# EAGLE design Adafruit KB2040 (EAGLE 9.6.2)
COMPANY: ADAFRUIT INDUSTRIES; DRAWN: KTOWN; REV: B
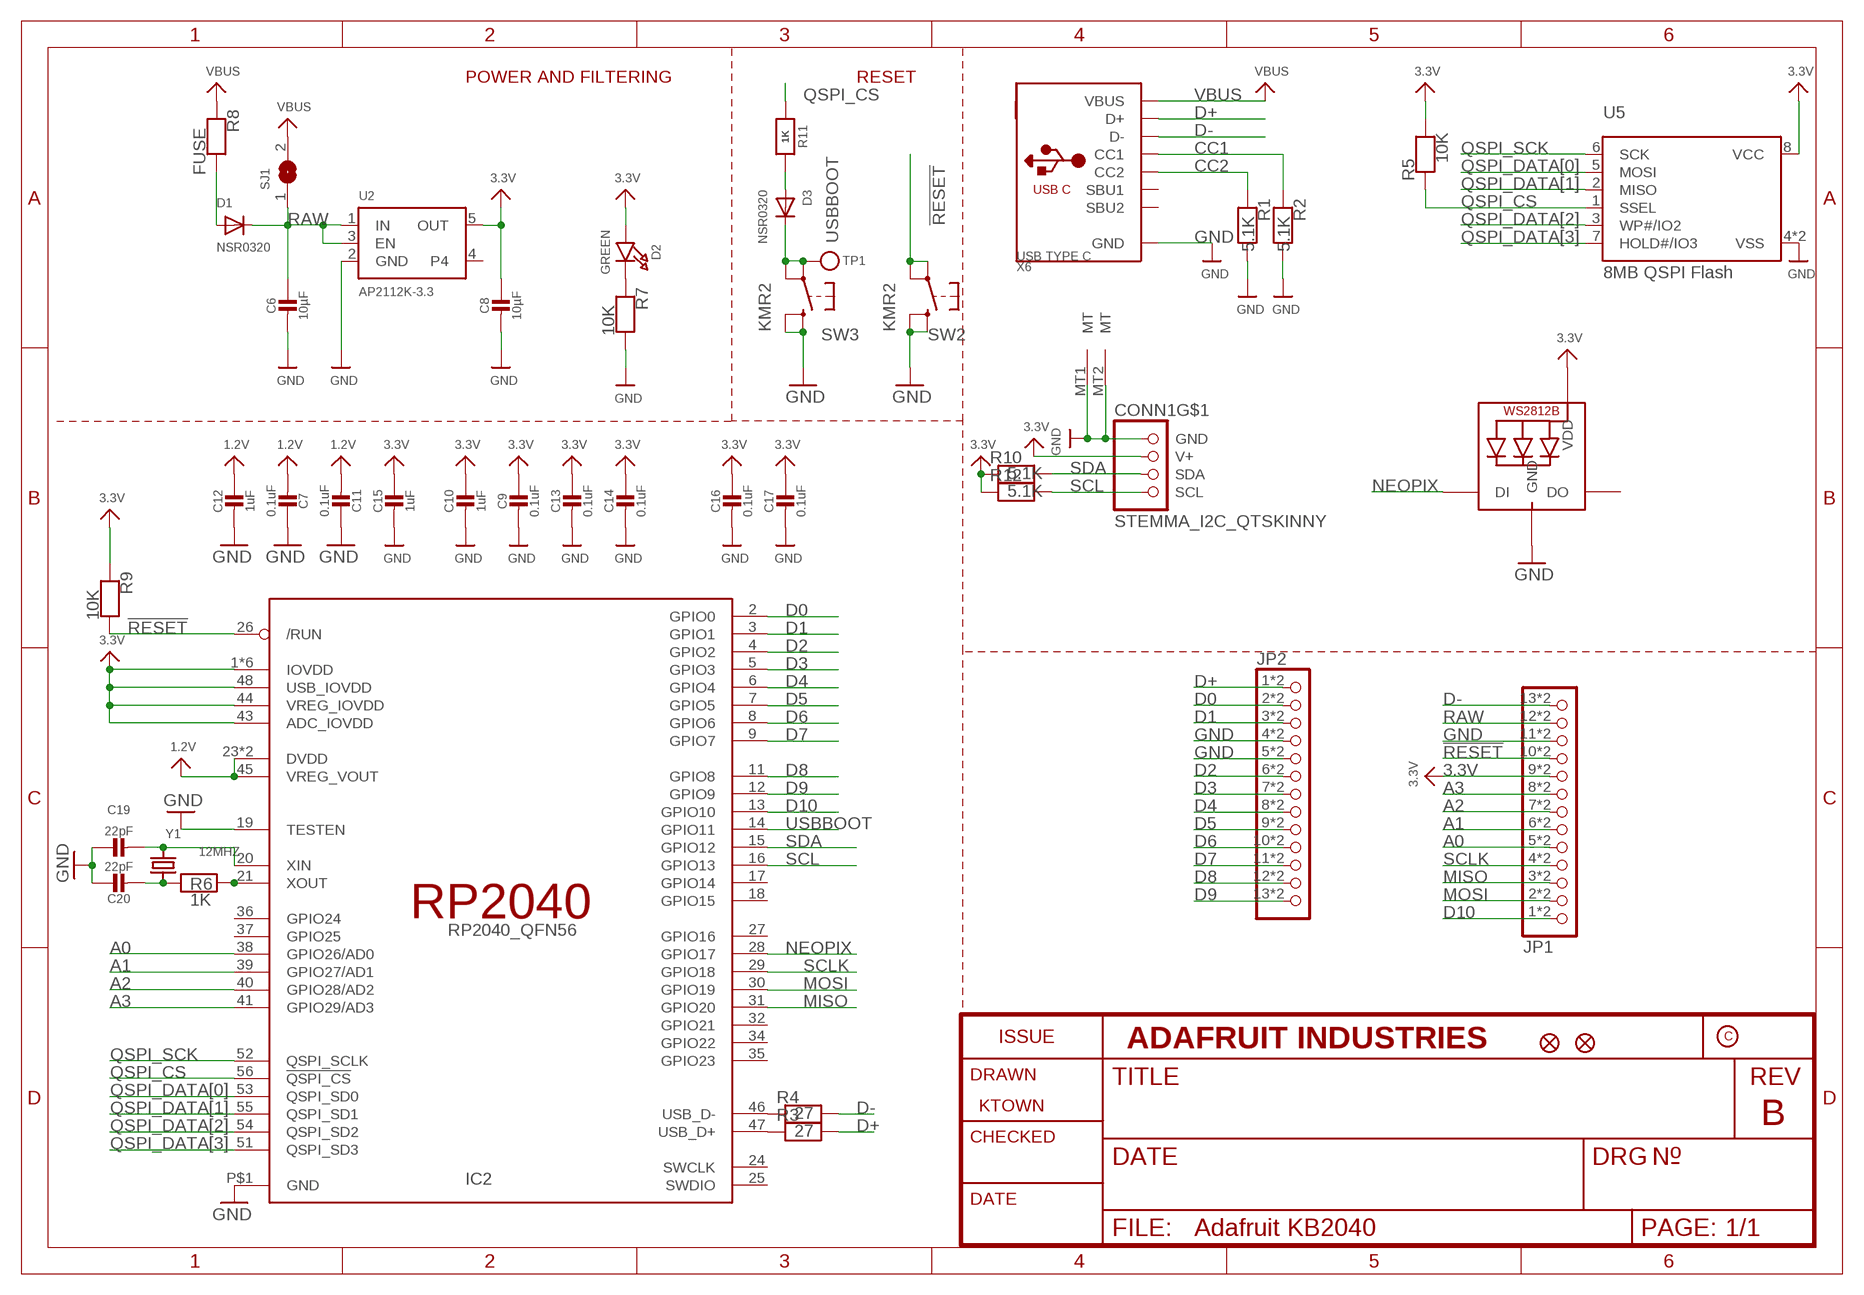
[diagram p0: schematic, sheet 1]

## Parts
C6  10µF  CAP_CERAMIC_0805MP  [_0805MP]
C7  0.1uF  CAP_CERAMIC_0402NO  [_0402NO]
C8  10µF  CAP_CERAMIC_0805MP  [_0805MP]
C9  0.1uF  CAP_CERAMIC_0402NO  [_0402NO]
C10  1uF  CAP_CERAMIC_0603MP  [_0603MP]
C11  0.1uF  CAP_CERAMIC_0402NO  [_0402NO]
C12  1uF  CAP_CERAMIC_0603MP  [_0603MP]
C13  0.1uF  CAP_CERAMIC_0402NO  [_0402NO]
C14  0.1uF  CAP_CERAMIC_0402NO  [_0402NO]
C15  1uF  CAP_CERAMIC0603_NO  [0603-NO]
C16  0.1uF  CAP_CERAMIC_0402NO  [_0402NO]
C17  0.1uF  CAP_CERAMIC_0402NO  [_0402NO]
C19  22pF  CAP_CERAMIC_0402NO  [_0402NO]
C20  22pF  CAP_CERAMIC_0402NO  [_0402NO]
CONN1  STEMMA_I2C_QTSKINNY  [JST_SH4_SKINNY]
D1  NSR0320  DIODESOD-323F  [SOD-323F]
D2  GREEN  LED0603_NOOUTLINE  [CHIPLED_0603_NOOUTLINE]
D3  NSR0320  DIODESOD-323F  [SOD-323F]
IC2  RP2040_QFN56  [QFN56_7MM_REDUCEDEPAD]
JP1  HEADER-1X13_CASTEL  [1X13_CASTEL]
JP2  HEADER-1X13_CASTEL  [1X13_CASTEL]
LED1  WS2812B_SK6805_1515  [SK6805_1515]
R1  5.1K  RESISTOR_0402NO  [_0402NO]
R2  5.1K  RESISTOR_0402NO  [_0402NO]
R3  27  RESISTOR_0402NO  [_0402NO]
R4  27  RESISTOR_0402NO  [_0402NO]
R5  10K  RESISTOR_0402NO  [_0402NO]
R6  1K  RESISTOR_0402NO  [_0402NO]
R7  10K  RESISTOR_0402NO  [_0402NO]
R8  FUSE  RESISTOR0805_NOOUTLINE  [0805-NO]
R9  10K  RESISTOR_0402NO  [_0402NO]
R10  5.1K  RESISTOR_0402NO  [_0402NO]
R11  1K  RESISTOR_0402NO  [_0402NO]
R12  5.1K  RESISTOR_0402NO  [_0402NO]
SJ1  SOLDERJUMPER  [SOLDERJUMPER_ARROW_NOPASTE]
SW2  KMR2  SWITCH_TACT_SMT4.6X2.8  [BTN_KMR2_4.6X2.8]
SW3  KMR2  SWITCH_TACT_SMT4.6X2.8  [BTN_KMR2_4.6X2.8]
TP1  TESTPOINTROUND1.5MMNO  [TESTPOINT_ROUND_1.5MM_NO]
U2  AP2112K-3.3  VREG_SOT23-5  [SOT23-5]
U5  8MB QSPI Flash  SPIFLASH_8PIN_4X4  [USON8_4X4]
U$34  FIDUCIAL_1MM  [FIDUCIAL_1MM]
U$35  FIDUCIAL_1MM  [FIDUCIAL_1MM]
X6  USB TYPE C  USB_C  [USB_C_CUSB31-CFM2AX-01-X]
Y1  12MHZ  CRYSTAL2.5X2.0  [CRYSTAL_2.5X2]

## Nets
1.2V [power]: C7.2 C11.2 C12.1 IC2.23(DVDD) IC2.45(VREG_VOUT) IC2.50(DVDD)
3.3V [power]: C8.1 C9.1 C10.1 C13.1 C14.1 C15.1 C16.1 C17.1 CONN1.2(V+) D2.A IC2.1(IOVDD) IC2.10(IOVDD) IC2.22(IOVDD) IC2.33(IOVDD) IC2.42(IOVDD) IC2.43(ADC_IOVDD) IC2.44(VREG_IOVDD) IC2.48(USB_IOVDD) IC2.49(IOVDD) JP1.9 JP1.9C LED1.2(VDD) R5.2 R9.1 R10.1 R12.1 U2.5(OUT) U5.8(VCC)
!RESET: IC2.26(/RUN) JP1.10 JP1.10C R9.2 SW2.A'(P1) SW2.A(P)
A0: IC2.38(GPIO26/AD0) JP1.5 JP1.5C
A1: IC2.39(GPIO27/AD1) JP1.6 JP1.6C
A2: IC2.40(GPIO28/AD2) JP1.7 JP1.7C
A3: IC2.41(GPIO29/AD3) JP1.8 JP1.8C
CC1: R2.1 X6.A5(CC1)
CC2: R1.1 X6.B5(CC2)
D0: IC2.2(GPIO0) JP2.2 JP2.2C
D1: IC2.3(GPIO1) JP2.3 JP2.3C
D2: IC2.4(GPIO2) JP2.6 JP2.6C
D3: IC2.5(GPIO3) JP2.7 JP2.7C
D4: IC2.6(GPIO4) JP2.8 JP2.8C
D5: IC2.7(GPIO5) JP2.9 JP2.9C
D6: IC2.8(GPIO6) JP2.10 JP2.10C
D7: IC2.9(GPIO7) JP2.11 JP2.11C
D8: IC2.11(GPIO8) JP2.12 JP2.12C
D9: IC2.12(GPIO9) JP2.13 JP2.13C
D10: IC2.13(GPIO10) JP1.1 JP1.1C
D+: JP2.1 JP2.1C R3.2 X6.A6(D+) X6.B6(D+)
D-: JP1.13 JP1.13C R4.2 X6.A7(D-) X6.B7(D-)
GND: C6.2 C7.1 C8.2 C9.2 C10.2 C11.1 C12.2 C13.2 C14.2 C15.2 C16.2 C17.2 C19.1 C20.1 CONN1.1(GND) CONN1.MT1(MT) CONN1.MT2(MT) IC2.19(TESTEN) IC2.P$1(GND) JP1.11 JP1.11C JP2.4 JP2.4C JP2.5 JP2.5C LED1.4(GND) R1.2 R2.2 R7.2 SW2.B'(S1) SW2.B(S) SW3.B'(S1) SW3.B(S) U2.2(GND) U5.4(VSS) U5.PAD(VSS) X6.A1B12(GND) X6.B1A12(GND)
MISO: IC2.31(GPIO20) JP1.3 JP1.3C
MOSI: IC2.30(GPIO19) JP1.2 JP1.2C
N$1: IC2.47(USB_D+) R3.1
N$2: D2.C R7.1
N$3: IC2.46(USB_D-) R4.1
N$4: D3.A R11.2
N$5: C19.2 IC2.20(XIN) Y1.3
N$6: C20.2 R6.1 Y1.1
N$7: IC2.21(XOUT) R6.2
N$8: D1.A R8.2
NEOPIX: IC2.28(GPIO17) LED1.1(DI)
QSPI_CS: IC2.56(!QSPI_CS) R5.1 R11.1 U5.1(SSEL)
QSPI_DATA[0]: IC2.53(QSPI_SD0) U5.5(MOSI)
QSPI_DATA[1]: IC2.55(QSPI_SD1) U5.2(MISO)
QSPI_DATA[2]: IC2.54(QSPI_SD2) U5.3(WP#/IO2)
QSPI_DATA[3]: IC2.51(QSPI_SD3) U5.7(HOLD#/IO3)
QSPI_SCK: IC2.52(QSPI_SCLK) U5.6(SCK)
RAW: C6.1 D1.C JP1.12 JP1.12C SJ1.1 U2.1(IN) U2.3(EN)
SCL: CONN1.4(SCL) IC2.16(GPIO13) R12.2
SCLK: IC2.29(GPIO18) JP1.4 JP1.4C
SDA: CONN1.3(SDA) IC2.15(GPIO12) R10.2
USBBOOT: D3.C IC2.14(GPIO11) SW3.A'(P1) SW3.A(P) TP1.P$1
VBUS: R8.1 SJ1.2 X6.A4B9(VBUS) X6.B4A9(VBUS)
Unconnected: IC2.17(GPIO14) IC2.18(GPIO15) IC2.24(SWCLK) IC2.25(SWDIO) IC2.27(GPIO16) IC2.32(GPIO21) IC2.34(GPIO22) IC2.35(GPIO23) IC2.36(GPIO24) IC2.37(GPIO25) LED1.3(DO) U2.4 X6.A8(SBU1) X6.B8(SBU2)

## Notes on the sheet
- POWER AND FILTERING | RESET

## Library data of the parts
C6 C7 C9-C17 C19 C20 = microbuilder:CAP_CERAMIC: Ceramic Capacitors For new designs, use the packages preceded by an '_' character since they are more reliable: The following footprints should be used on most boards: _0402 - Standard footprint for regular board layouts _0603 - Standard footprint for regular board layouts _0805 - Standard footprint for regular board layouts _1206 - Standard footprint for regular board layouts For extremely tight-pitch boards where space is at a premium, the following 'micro-pitch' footprints can be used (smaller pads, no silkscreen outline, etc.): _0402MP - Micro-pitch footprint for very dense/compact boards _0603MP - Micro-pitch footprint for very dense/compact boards _0805MP - Micro-pitch footprint for very dense/compact boards _1206MP - Micro-pitch footprint for very dense/compact boards
C8 = microbuilder:CAP_CERAMIC: Ceramic Capacitors For new designs, use the packages preceded by an '_' character since they are more reliable: The following footprints should be used on most boards: _0402 - Standard footprint for regular board layouts _0603 - Standard footprint for regular board layouts _0805 - Standard footprint for regular board layouts _1206 - Standard footprint for regular board layouts For extremely tight-pitch boards where space is at a premium, the following 'micro-pitch' footprints can be used (smaller pads, no silkscreen outline, etc.): _0402MP - Micro-pitch footprint for very dense/compact boards _0603MP - Micro-pitch footprint for very dense/compact boards _0805MP - Micro-pitch footprint for very dense/compact boards _1206MP - Micro-pitch footprint for very dense/compact boards; REV: B
CONN1 = microbuilder:STEMMA_I2C
D1 D3 = adafruit:DIODE: Diode SMADIODE - SMA Surface Mount Package 20V 1A Schottky Diode Digikey: 641-1014-6-ND DO-1N4148 - Through Hole Small Current Diode SOD-123 20V 1 A (.5mV Vf) Schottky Diode - Digikey: MBRX120TPMSCT-ND SOD-323 10V 570mA (.38mV Vf, 3ns) Schottky Diode - Digikey: ZLLS410CT-ND SOD-523 30V 30mA Schottky Diode (RB751S-40TE61) - Digikey: RB751S-40TE61CT-ND SOT23-R/W - SOT23 Package (R = Solder Paste/Reflow Ovens, W = Hand-Soldering) BAT54Film 40V 300mA - Digikey: 497-7162-1-ND
D2 = microbuilder:LED: LED 0603 - 0603 Surface Mount Package 2mA: Green LED - Low Power (3.9mcd, 2ma, 1.7Vf) - Digikey: 475-2709-2-ND Orange LED - Low Power (9.8mcd, 2ma, 1.8Vf) - Digikey: 475-1194-2-ND Red LED - Low Power (5mcd, 2ma, 1.8Vf) - Digikey: 475-1195-2-ND Yellow LED - Low Power (7mcd, 2ma, 1.8Vf) - Digikey: 475-1196-2-ND 5mA: Blue LED - Low Power (17mcd, 5ma, 2.9Vf) - Digikey: LNJ937W8CRACT-ND 0805 - 0805 Surface Mount Package 2mA: Red LED (8.8mcd, 2mA, 1.8Vf, Clear) - Low Power [Digikey: 475-2510-1-ND] Green LED (5mcd, 2mA, 1.8Vf, Clear) - Low Power [Digikey: 475-2730-1-ND] Yellow LED (11.3mcd, 2mA, 1.8Vf, Clear) - Low Power [Digikey: 475-2555-1-ND] 20mA: Red LED (104mcd, 20mA, Diffused) - LS R976 [Digikey: 475-1278-6-ND] Red LED (12mcd, 20mA, 2.0Vf, Clear) - APT2012EC [Digikey: 754-1128-1-ND] Green LED (15mcd, 20mA, 2.2Vf, Clear) - APT2012GC [Digikey: 754-1131-1-ND] Orange LED (160mcd, 20mA, 2.1Vf, Clear) - APT2012SECK [Digikey: 754-1130-1-ND] 1206 - 1206 Surface Mount Package Green LED (26mcd, 20mA, Diffused) - LG N971 [Digikey: 475-1407-6-ND] Red LED (15mcd, 20mA, Diffused) - LH N974 [Digikey: 475-1416-6-ND] Cree - Cree High-Power Surface Mount LEDs XPEBWT-L1-0000-00D50 - White 111lm 350mA 2.9Vf 6200K 110° XTEAWT-00-0000-00000LEE3 - White 114lm 350mA 2.85Vf 5000K 115° Everlight - Everlight 45-21 Series Surface Mount LEDs 45-21/QK2C-B2832AC2CB2/2T - Warm White 2000mcd 20mA 3.25Vf 3050K 120° 45-21/LK2C-B38452C4CB2/2T - Nuetral White 2000mcd 20mA 3.25Vf 4150K 120° 45-21/LK2C-B50634C6CB2/2T - Cold White 2200mcd 20mA 3.25Vf 5650K 120° PLCC2 Reverse Mount LS T77K-J1L2-1-0-2-R18-Z - Red 11.25mcd 2mA 1.8Vf 630nm 120° LO T77K-L1M2-24-Z - Orange 19.6mcd 2mA 1.8Vf 606nm 120° LY T77K-K2M1-26-Z - Yellow 15.7mcd 2mA 1.8Vf 587nm 120°
IC2 = adafruit_micro:RP2040
JP1 JP2 = microbuilder:HEADER-1X13
LED1 = microbuilder:WS2812B
R1-R12 = microbuilder:RESISTOR: Resistors For new designs, use the packages preceded by an '_' character since they are more reliable: The following footprints should be used on most boards: _0402 - Standard footprint for regular board layouts _0603 - Standard footprint for regular board layouts _0805 - Standard footprint for regular board layouts _1206 - Standard footprint for regular board layouts For extremely tight-pitch boards where space is at a premium, the following 'micro-pitch' footprints can be used (smaller pads, no silkscreen outline, etc.): _0402MP - Micro-pitch footprint for very dense/compact boards _0603MP - Micro-pitch footprint for very dense/compact boards _0805MP - Micro-pitch footprint for very dense/compact boards _1206MP - Micro-pitch footprint for very dense/compact boards
SJ1 = microbuilder:SOLDERJUMPER: SMD Solder JUMPER Solder the two pads together to create a connection, or remove the solder to break it. REFLOW - Use this footprint for solder paste and reflow ovens. WAVE - Use this footprint for hand-soldering (larger pads). CLOSED - Has a trace between the two pads to ensure it is closed by default. The trace needs to be cut to disable the jumper, and can be closed again by creating a solder bridge between the two pads.; BOM: EXCLUDE
SW2 SW3 = microbuilder:SWITCH_TACT_SMT: SMT Tact Switches 6x6mm - Digikey: P12940SCT-ND KMR2 (4.6x2.8mm) - Digikey: 401-1426-1-ND EVQ-PQHB55 - Light Touch, 160GF (4.5x4.5mm) - Digikey: P8090SCT-ND KMT0 - KMT021 NGJ LHS (etc.) IP68/Waterproof - Digikey: CKN10289CT-ND
TP1 = microbuilder:TESTPOINT: Test Point Various test points for characterisation and PCB testing TESTPOINT_SMT - Compact Surface Mount Test Point [Digikey: 5016KTR-ND]
U2 = microbuilder:VREG_SOT23-5: SOT23-5 Fixed Voltage Regulators Part Current Out V Out V In V Dropout θJA (°C/W) TJ (°C) Digikey Part No. ADP121 150mA 3.3V 3.4-5.5V 0.09V @ 150mA -- -- ADP121-AUJZ33R7CT-ND ADP121 150mA 3.0V 3.1-5.5V 0.09V @ 150mA -- -- ADP121-AUJZ30R7CT-ND ADP122 300mA 3.3V 3.4-5.5V 0.085V @ 300mA -- -- ADP122AUJZ-3.3-R7CT-ND ADP1712 300mA 3.3V 3.5-5.5V 0.17V @ 300mA -- -- ADP1712AUJZ-3.3-R7TR-ND AP7311 (Low Cost) 150mA 3.3V 3.5-6V 0.15V @ 150mA -- -- AP7311-33WG-7DICT-ND LD39015M18R 150mA 1.8V 1.9V-5.5V 0.08V @ 100mA -- -- 497-6977-1-ND LP2985A-33DBVR 150mA 3.3V 3.3-16V 0.28V @ 150mA 206 150 296-18479-1-ND MCP1824T-3302E/OT 300mA 3.3V 3.5V-6V 0.2V @ 300mA -- -- MCP1824T-3302E/OTCT-ND MIC5205-2.5YM5 TR 150mA 2.5V 2.7-16V 0.165V @ 150mA -- -- 576-1257-2-ND MIC5205-3.0YM5 TR 150mA 3.0V 3.2V-16V 0.165V @ 150mA -- -- 576-1258-2-ND MIC5205-3.3YM5 TR 150mA 3.3V 3.5V-16V 0.165V @ 150mA -- -- 576-1259-2-ND TPS780330220 150mA 3.3V+2.2V 3.6-5.5V 250mV Max -- -- 296-23332-1-ND TDA3663/N1,135 100mA 3.3V 3.5-45V 0.18V @ 50mA -- -- 568-5343-1-ND Max operating temp can be calculated using θJA, TJ (max junction temperature), and power in watts. Set the "Maximum Ambient Temperature" until it reaches TJ ("Max Junction Temperature"), which is the absolute limit for safe use of the regulator: Heat Sink Temperature Calculator <http://www.daycounter.com/Calculators/Heat-Sink-Temperature-Calculator.phtml> For example, With 12V source into a 3.3V LP2985 and a 30mA load, we are dissipating (12V-3.3V) * 0.03A = 0.261W. With a θJA of 206 °C/W, a TJ of 150°C, and 261mW we can safely use the chip without a heat sink up to 75°C (=147.1°C Junction Temperature).
U5 = microbuilder:SPIFLASH_8PIN: SOIC8 SPI Flash Be careful with the size since SOIC8 flash comes in several 'widths' SOIC8 150 mil M25P16 - 16Mbit (2Mbit x 8) Serial Flash (75MHz SPI Bus), Supply: 2.7-3.6V Digikey: SOIC8 - M25P16-VMN6P-ND SOIC8 208 mil W25Q16BVSSIG - 16Mbit (2Mbit x 8) Serial Flash (104MHz SPI Bus), Supply: 2.7-3.6V Digikey: SOIC8 - W25Q16BVSSIG-ND
U$34 U$35 = microbuilder:FIDUCIAL: Fiducial Alignment Points Various fiducial points for machine vision alignment.; BOM: EXCLUDE
X6 = adafruit_electromech:USB_C: USB Type-C USB 2.0 Connector
Y1 = microbuilder:CRYSTAL: Crystals HC49UP - Surface Mount Crystal 4.0MHz 18pF +/-30ppm Surface Mount Crystal [Digikey: 535-9857-1-ND] 12.0 MHz Surface Mount Crystal [Digikey: 535-9869-6-ND] 25.0 MHz Surface Mount Crystal [Digikey: 535-9078-1-ND] 2.5 x 2.0mm - MEMs SMT Crystal 16.0 MHz 10pF 20ppm 2.5 x 2.0mm Crystal [Digikey -40-85°C: 535-10923-1-ND] 3.2 x 2.5mm - MEMs SMT Crystal 12.0 MHz 8pF 15ppm 3.2 x 2.5mm Crystal [Digikey: -10-70°C: 644-1047-1-ND -40-125°C: 644-1128-1-ND] 40~85°C cheaper: 644-1173-6-ND 16.0 MHz 8pF 15ppm 3.2 x 2.5mm Crystal [Digikey: -10-70°C: 644-1049-1-ND -40-125°C: 644-1129-2-ND]-40~85°C cheaper: 644-1175-6-ND 16.0 MHz 10pF 10ppm 3.2 x 2.5mm Crystal [Digikey: 644-1100-1-ND] 27.12 MHz 18pF 30ppm 3.2 x 2.5mm Crystal [Digikey: 887-1424-1-ND] 27.12MHz 10pF 10ppm 3.2 x 2.5mm Crystal [Digikey: 887-1329-1-ND] 4.9 x 1.8mm - MEMs SMT Crystal 32.768 KHz 12.5pF 20ppm 4.9 x 1.8mm Crystal [Digikey: SE2415CT-ND] 8.0 x 3.8mm - Surface Mount Crystal 32.768kHz 12.5pF 20ppm -40°C-85°C [Digikey: 535-9166-2-ND] Cylinder 32.768KHz Cylinder Crystal (2x6mm body) [Ex. Digikey: 300-8341-2-ND]

## Net classes
1 power: width 0.203 mm

## Board
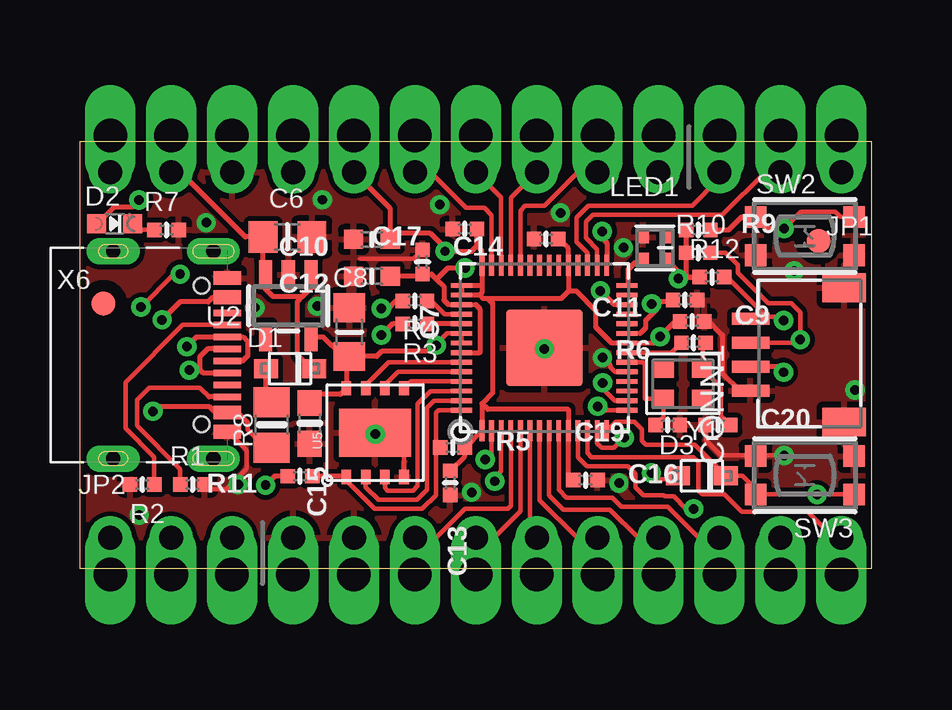
[diagram p1: board, top side]
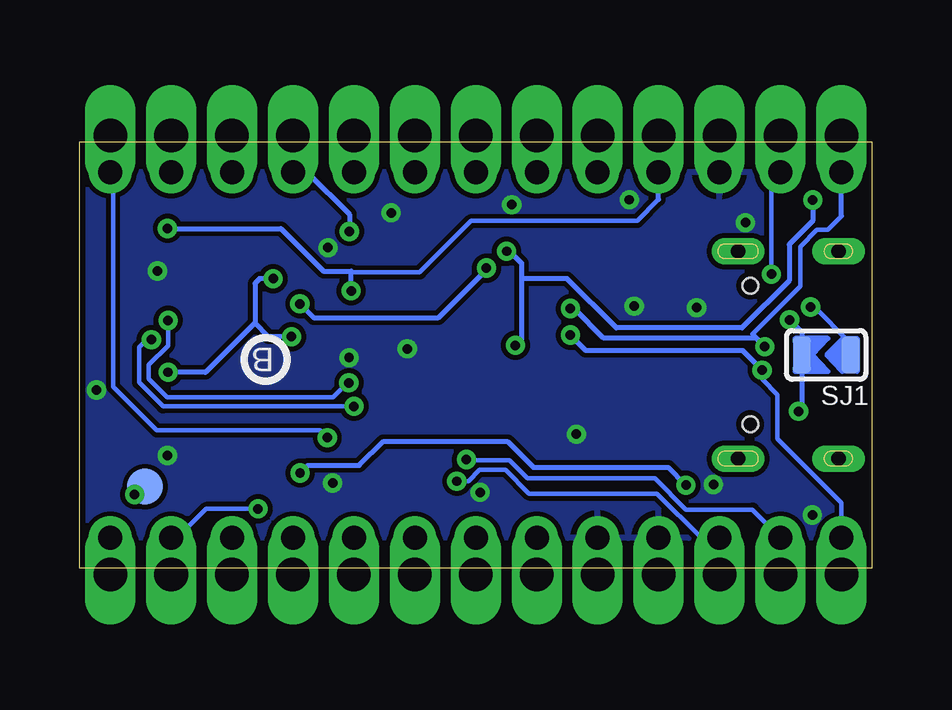
[diagram p2: board, bottom side, seen from below]

Size 33.02 x 17.78 mm. Coordinates in mm from the lower left corner, seen from the top.
Outline: 0,17.78 0,0 33.02,0 33.02,17.78 0,17.78
Copper layers (1*16): Top 0.035mm / dielectric 1.5mm / Bottom 0.035mm
Design rules "adafruit 7-7 *": minimum track width 7mil, minimum drill 15.5mil, track to track 8mil, track to pad 7mil, pad to pad 7mil, via to via 7mil, smd to smd 7mil, copper to edge 10mil, drill to drill 8mil, minimum pad ring 10mil, minimum via ring 8mil, stop-mask expansion 2mil, vias tented up to drill 20mil, thermal gap 10mil

### Footprints (pad centres in the part's own frame; a part is rotated, then mirrored left to right if it is on the bottom)
_0805MP = smd 1.2 x 1.3: 1 -1.016,0; 2 1.016,0
_0402NO = smd 0.6 x 0.6: 1 -0.508,0; 2 0.508,0
_0603MP = smd 0.8 x 0.8: 1 -0.762,0; 2 0.762,0
0603-NO = smd 1.075 x 1: 1 -0.85,0; 2 0.85,0
JST_SH4_SKINNY = smd 0.5 x 1.55: 1 -1.5,2.514; 2 -0.5,2.514; 3 0.5,2.514; 4 1.5,2.514 | smd 1.2 x 1.8: MT1 -2.8,-1.386; MT2 2.8,-1.386
SOD-323F = smd 1 x 0.8: A -1,0; C 1,0
CHIPLED_0603_NOOUTLINE = smd 0.8 x 0.8: A 0,-0.75; C 0,0.75
QFN56_7MM_REDUCEDEPAD = smd 0.875 x 0.2: 1 -3.45,2.6; 2 -3.45,2.2; 3 -3.45,1.8; 4 -3.45,1.4; 5 -3.45,1; 6 -3.45,0.6; 7 -3.45,0.2; 8 -3.45,-0.2; 9 -3.45,-0.6; 10 -3.45,-1; 11 -3.45,-1.4; 12 -3.45,-1.8; 13 -3.45,-2.2; 14 -3.45,-2.6; 29 3.45,-2.6; 30 3.45,-2.2; 31 3.45,-1.8; 32 3.45,-1.4; 33 3.45,-1; 34 3.45,-0.6; 35 3.45,-0.2; 36 3.45,0.2; 37 3.45,0.6; 38 3.45,1; 39 3.45,1.4; 40 3.45,1.8; 41 3.45,2.2; 42 3.45,2.6 | smd 0.2 x 0.875: 15 -2.6,-3.45; 16 -2.2,-3.45; 17 -1.8,-3.45; 18 -1.4,-3.45; 19 -1,-3.45; 20 -0.6,-3.45; 21 -0.2,-3.45; 22 0.2,-3.45; 23 0.6,-3.45; 24 1,-3.45; 25 1.4,-3.45; 26 1.8,-3.45; 27 2.2,-3.45; 28 2.6,-3.45; 43 2.6,3.45; 44 2.2,3.45; 45 1.8,3.45; 46 1.4,3.45; 47 1,3.45; 48 0.6,3.45; 49 0.2,3.45; 50 -0.2,3.45; 51 -0.6,3.45; 52 -1,3.45; 53 -1.4,3.45; 54 -1.8,3.45; 55 -2.2,3.45; 56 -2.6,3.45 | smd 3.2 x 3.2: P$1 0,0
1X13_CASTEL = drill 1 pad 1.778: 1 -15.24,0; 2 -12.7,0; 3 -10.16,0; 4 -7.62,0; 5 -5.08,0; 6 -2.54,0; 7 0,0; 8 2.54,0; 9 5.08,0; 10 7.62,0; 11 10.16,0; 12 12.7,0; 13 15.24,0 | drill 1.397 pad 1.778 long: 1C -15.24,-1.524; 2C -12.7,-1.524; 3C -10.16,-1.524; 4C -7.62,-1.524; 5C -5.08,-1.524; 6C -2.54,-1.524; 7C 0,-1.524; 8C 2.54,-1.524; 9C 5.08,-1.524; 10C 7.62,-1.524; 11C 10.16,-1.524; 12C 12.7,-1.524; 13C 15.24,-1.524
SK6805_1515 = smd 0.5 x 0.5: 1 -0.5,-0.45; 2 0.5,-0.45; 3 0.5,0.45; 4 -0.5,0.45
0805-NO = smd 1.24 x 1.5: 1 -0.95,0; 2 0.95,0
SOLDERJUMPER_ARROW_NOPASTE = smd 0.762 x 1.524: 1 -1.016,0; 2 1.016,0
BTN_KMR2_4.6X2.8 = smd 0.9 x 0.9: A 2.05,0.8; A' -2.05,0.8; B 2.05,-0.8; B' -2.05,-0.8
TESTPOINT_ROUND_1.5MM_NO = smd 1.5 x 1.5: P$1 0,0
SOT23-5 = smd 0.55 x 1.2: 1 -0.95,-1.3; 2 0,-1.3; 3 0.95,-1.3; 4 0.95,1.3; 5 -0.95,1.3
USON8_4X4 = smd 0.6 x 0.4: 1 -1.85,1.2; 2 -1.85,0.4; 3 -1.85,-0.4; 4 -1.85,-1.2; 5 1.85,-1.2; 6 1.85,-0.4; 7 1.85,0.4; 8 1.85,1.2 | smd 2 x 3: PAD 0,0
FIDUCIAL_1MM = smd 1 x 1: 1 0,0
USB_C_CUSB31-CFM2AX-01-X = smd 0.575 x 1.15: A1B12 -3.2,3.545; A4B9 -2.4,3.545; B1A12 3.2,3.545; B4A9 2.4,3.545 | smd 0.275 x 1.15: A5 -1.25,3.545; A6 -0.25,3.545; A7 0.25,3.545; A8 1.25,3.545; B5 1.75,3.545; B6 0.75,3.545; B7 -0.75,3.545; B8 -1.75,3.545 | drill 0.6 pad 1 long: M1 -4.32,2.97; M2 4.32,2.97; M3 -4.32,-1.21; M4 4.32,-1.21 | hole 0.65: 2.89,2.47; -2.89,2.47
CRYSTAL_2.5X2 = smd 0.9 x 0.75: 1 -0.825,-0.625; 2 0.825,-0.625; 3 0.825,0.625; 4 -0.825,0.625

### Placement (x,y rotation side)
C6  8.66,13.8 0 top
C7  14.29,12.76 270 top
C8  11.24,9.84 90 top
C9  25.53,10.29 0 top
C10  12.18,13.7 180 top
C11  25.23,11.18 180 top
C12  12.18,12.17 180 top
C13  15.44,3.56 270 top
C14  19.44,13.72 180 top
C15  9.59,6.03 270 top
C16  21.08,3.67 0 top
C17  16.05,14.14 180 top
C19  24.51,5.97 180 top
C20  26.61,5.97 0 top
CONN1  30.48,8.89 90 top
D1  8.76,8.32 0 top
D2  1.46,14.35 270 top
D3  25.93,3.85 0 top
IC2  19.37,9.18 90 top
JP1  16.51,16.51 180 top
JP2  16.51,1.27 0 top
LED1  23.98,13.35 0 top
R1  4.7,3.49 0 top
R2  2.6,3.49 180 top
R3  13.97,10.19 180 top
R4  13.97,11.14 180 top
R5  15.54,5.03 0 top
R6  25.59,9.4 180 top
R7  3.62,14.1 0 top
R8  8,5.97 90 top
R9  25.78,14.1 0 top
R10  25.78,13.14 0 top
R11  9.18,3.84 180 top
R12  26.35,12.13 0 top
SJ1  1.91,8.89 180 bottom
SW2  30.23,13.84 0 top
SW3  30.23,3.87 180 top
TP1  30.3,3.4 0 bottom
U2  8.7,10.93 180 top
U5  12.32,5.65 90 top
U$17  [KB2040_BOT]  0,17.78 180 bottom
U$19  [KB2040_TOP]  0,0 0 top
U$20  [PCBFEAT-REV-040]  25.27,8.7 180 bottom
U$34  30.8,13.64 270 top
U$35  0.99,11.03 270 top
X6  2.6,8.89 270 top
Y1  25.15,7.68 180 top

### Tracks (layer width: path | path; a pad name or v marks a point on that pad's centre or on a via)
1.2V  (via drill 0.39)
  Top 0.178: 15.37,10.98 IC2.45 16.51,10.98 | 23.37,9.78 IC2.23
  Top 0.203: 15.37,10.98 15.18,11.18 15.18,11.75 14.86,12.06 | C11.2 24.66,11.11 23.94,11.11 v23.84,11.02 24.04,10.83 24.04,10.76 23.59,10.32 23.59,10 23.37,9.78 | IC2.50 16.67,8.98 16.7,9.02 16.7,10.79 16.51,10.98 | C12.1 14.2,12.17 C7.2 14.67,12.26 14.86,12.06 | v16.07,12.51 15.33,12.51 14.89,12.06 14.86,12.06
  Bottom 0.203: v23.84,11.02 23.27,10.45 18.07,10.45 16.07,12.45 v16.07,12.51
3.3V  (via drill 0.39)
  Top 0.178: IC2.49 IC2.48 15.31,9.78 14.86,9.34 | IC2.22 23.75,9.38
  Top 0.203: U2.5 10.15,9.63 10.96,8.83 C8.1 | C15.1 9.65,6.88 10.02,7.25 10.87,7.25 U5.8 11.12,8.71 C8.1 | 14.86,9.34 v14.86,9.29 14.61,9.04 12.59,9.04 12.38,8.83 C8.1 | 16.68,11.39 16.83,11.24 17.02,11.24 | 16.77,11.81 IC2.42 16.77,13.23 16.56,13.44 | 16.77,11.81 16.77,11.48 16.68,11.39 | IC2.44 IC2.43 16.74,11.78 16.77,11.81 | 20.37,11.54 IC2.33 20.37,13.33 19.98,13.72 C14.1 | 17.02,11.24 20.07,11.24 20.37,11.54 | C16.1 20.37,3.67 IC2.10 20.37,6.62 17.01,6.62 16.77,6.86 | 23.75,9.38 23.92,9.38 v24.19,9.65 24.83,10.29 C9.1 | 17.02,11.24 17.21,11.05 17.21,7.3 16.77,6.86 | 16.77,6.86 IC2.1 16.76,5.73 R5.2 16.05,4.67 C13.1 | 16.56,13.44 C17.1 | IC2.22 22.18,9.38 21.53,10.03 21.53,10.73 20.72,11.54 20.37,11.54 | 16.56,13.44 16.33,13.21 v15.23,13.21 15.23,13.35 14.62,13.96 13.06,13.96 12.94,13.84 | v29.34,8.17 29.11,8.39 CONN1.2 | IC2.44 | IC2.44 16.68,11.39 | LED1.2 24.48,12.84 24.96,12.36 v24.96,12.06 24.96,12.13 R12.1 25.27,12.13 R10.1 R9.1 | D2.A 1.41,15.05 2.17,15.05 v2.46,15.34 | JP1.9C JP1.9 12.94,15 12.94,13.84 | 12.94,13.84 C10.1
  Bottom 0.203: v14.86,9.29 14.61,9.54 14.61,12.06 | 14.61,12.06 14.61,12.71 15.1,13.21 v15.23,13.21 | v24.19,9.65 25.15,9.65 25.72,10.22 | 25.72,10.22 25.72,11.87 25.53,12.06 v24.96,12.06 | 25.72,10.22 27.77,8.17 v29.34,8.17 | v2.46,15.34 2.46,14.48 3.44,13.5 3.44,11.99 5.41,10.02 10.65,10.02 12.7,12.06 14.61,12.06
!RESET  (via drill 0.39)
  Top 0.178: SW2.A 31.71,14.64 31.5,14.86 30.06,14.86 v29.36,14.16 28.66,14.16 SW2.A'
  Top 0.203: R9.2 27.05,14.1 27.6,14.64 SW2.A' | IC2.26 22.28,10.98 v21.7,11.56 | JP1.10C JP1.10
  Bottom 0.178: 8.89,15.37 9.78,14.48 16.7,14.48 18.85,12.33 21.65,12.33 | v29.36,14.16 29.35,14.15
  Bottom 0.203: 29.35,14.15 24.63,14.15 22.86,12.38 21.7,12.38 | v21.7,11.56 21.7,12.38 | 8.89,15.37 JP1.10 | 21.65,12.33 21.7,12.38
A0
  Top 0.178: IC2.38 18.37,14.9 18.57,15.1 19.37,15.1 20.78,16.51 JP1.5
  Top 0.203: JP1.5C JP1.5
A1
  Top 0.178: IC2.39 17.97,15.43 18.8,16.26
  Top 0.203: 18.8,16.26 JP1.6 JP1.6C
A2
  Top 0.178: IC2.40 17.57,15.45 16.76,16.26
  Top 0.203: 16.76,16.26 JP1.7 JP1.7C
A3
  Top 0.178: IC2.41 17.17,14.71 16.87,15.01 16.1,15.01 14.55,16.56
  Top 0.203: 14.55,16.56 14.02,16.56 JP1.8 JP1.8C
CC1
  Top 0.178: X6.A5 4.3,10.14 1.91,7.75 1.91,5.84 3.11,4.64 R2.1
CC2
  Top 0.178: 5.39,7.14 5,7.52 2.88,7.52 2.38,7.02 2.38,5.93 4.19,4.13 R1.1
  Top 0.203: X6.B5 5.39,7.14
D0  (via drill 0.39)
  Top 0.178: IC2.2 17.17,4.79 v16.9,4.53
  Top 0.203: JP2.2C JP2.2
  Bottom 0.178: v16.9,4.53 16.88,4.5 15.11,4.5 14.36,3.75 9.05,3.75 7.74,2.44 4.98,2.44 JP2.2
D1  (via drill 0.39)
  Top 0.178: IC2.3 17.57,4.04 17.23,3.7 v17.3,3.63
  Top 0.203: JP2.3C JP2.3
  Bottom 0.178: v17.3,3.63 16.82,3.63 16.35,4.1 15.27,4.1 14.28,3.11 8.95,3.11 7.11,1.27 JP2.3
D2
  Top 0.178: IC2.4 17.97,2.6 17.84,2.48 16.07,2.48 14.86,1.27 14.29,1.27 JP2.6
  Top 0.203: JP2.6C 13.97,0.95 14.29,1.27
D3
  Top 0.178: IC2.5 18.37,2.37 17.27,1.27 JP2.7
  Top 0.203: JP2.7C JP2.7
D4
  Top 0.178: IC2.6 18.77,1.55 JP2.8
  Top 0.203: JP2.8C JP2.8
D5
  Top 0.178: IC2.7 19.17,2.84 20.74,1.27 JP2.9
  Top 0.203: JP2.9C JP2.9
D6
  Top 0.178: IC2.8 19.57,3.04 20.17,2.44 22.11,2.44 23.28,1.27 JP2.10
  Top 0.203: JP2.10C JP2.10
D7
  Top 0.178: JP2.11 25.82,1.27 24.52,2.56 22.58,2.56 22.2,2.95 20.3,2.95 19.97,3.27 IC2.9
  Top 0.203: JP2.11C JP2.11
D8  (via drill 0.39)
  Top 0.178: IC2.11 20.77,4.63 21.14,4.25 22.85,4.25 23.17,3.94 23.17,3.38 23.5,3.05 24.33,3.05 24.39,2.99 24.76,2.99 25.27,2.48 v25.59,2.48
  Top 0.203: JP2.12C JP2.12
  Bottom 0.178: JP2.12 29.21,1.4 28.83,1.4 27.75,2.48 v25.59,2.48
D9
  Top 0.178: IC2.12 21.17,4.8 21.34,4.64 25.59,4.64 25.78,4.45 25.78,3.24 25.95,3.07 26.87,3.07 27.6,2.35 28.74,2.35 28.83,2.44 30.26,2.44 31.43,1.27 JP2.13
  Top 0.203: JP2.13C JP2.13
D10  (via drill 0.39)
  Top 0.178: IC2.13 21.57,5.22 21.77,5.02 22.27,5.02 v22.7,5.44
  Top 0.203: JP1.1C JP1.1
  Bottom 0.178: v22.7,5.44 23,5.75 29.81,5.75 31.64,7.57 31.64,15.81
  Bottom 0.203: JP1.1 31.75,15.93 31.64,15.81
D+  (via drill 0.39)
  Top 0.203: R3.2 13.04,10.19 v12.57,9.72 | v4.57,8.26 5.02,8.26 | X6.A6 5.33,9.14 5.02,8.83 5.02,8.26 | X6.B6 6.14,8.13 5.14,8.13 5.02,8.26 | JP2.1C JP2.1
  Bottom 0.178: v4.57,8.26 4.57,7.87 3.94,7.24 3.94,5.4 1.27,2.73 JP2.1
  Bottom 0.203: v12.57,9.72 11.93,9.08 5.4,9.08 v4.57,8.26
D-  (via drill 0.39)
  Top 0.203: R4.2 13.17,11.14 12.85,10.82 v12.57,10.82 | v4.46,9.23 4.87,9.64 X6.B7 6.81,9.64 7,9.44 7,8.85 6.8,8.64 X6.A7 | JP1.13C JP1.13
  Bottom 0.178: 1.27,14.67 1.84,14.1 2.29,14.1 2.98,13.4 2.98,11.75 4.98,9.75
  Bottom 0.203: v12.57,10.82 12.41,10.82 11.2,9.61 4.84,9.61 | v4.46,9.23 4.47,9.24 4.84,9.61 | 4.84,9.61 4.98,9.75 | 1.27,14.67 JP1.13
GND  (via drill 0.39)
  Top 0.178: C20.1 26.1,5.33 26.73,4.7 v29.36,4.7 | U5.4 13.52,5.14 13.65,5.27 13.27,5.65 U5.PAD | X6.B1A12 6.18,5.69 6.95,4.93 6.95,4.15 6.1,3.3 5.21,3.3 R1.2 | SW2.B 32.28,12.1 CONN1.MT2 | C7.1 13.91,12.89 11.68,12.89 | v21.79,8.78 22.11,8.46 22.11,8.37 22.3,8.18 IC2.19
  Top 0.203: CONN1.1 27.54,7.39 26.8,8.13 26.8,9.72 26.23,10.29 C9.2 | JP2.5C JP2.5 | JP2.4C JP2.4
  other vias: 7.3,10.86 22.48,3.56 12.32,5.59 10.11,15.35 15.01,15.15 20.04,14.81 22.67,13.36 29.78,12.38 32.32,7.43 5.27,14.4 2.48,2.22 9.91,10.92 19.37,9.14 6.6,3.49 16.33,3.16
  pour Top: 0,17.72 33.02,17.72 33.02,-0.06 0,-0.06
  pour Bottom: 0,17.72 33.02,17.72 33.02,-0.06 0,-0.06
MISO
  Top 0.178: IC2.31 21.17,13.15 20.71,13.61 20.71,14.61 21.2,15.1 25.53,15.1 26.59,16.16 26.79,16.36
  Top 0.203: JP1.3 26.67,16.24 26.59,16.16 | JP1.3C 26.67,16.48 26.79,16.36
MOSI
  Top 0.178: IC2.30 21.57,13.29 21.1,13.76 21.1,14.43 21.39,14.72 26.78,14.72 28.57,16.51
  Top 0.203: JP1.2C JP1.2 28.96,16.51 28.57,16.51
N$1
  Top 0.203: IC2.47 R3.1
N$2
  Top 0.178: R7.1 2.46,14.1 D2.C
N$3
  Top 0.178: IC2.46 15.2,10.58 14.64,11.14 R4.1
N$4  (via drill 0.39)
  Top 0.178: D3.A 24.8,3.71 24.09,3.71 v23.84,3.97
  Top 0.203: R11.2 8.12,3.83 v7.75,3.46
  Bottom 0.203: v23.84,3.97 23.52,4.29 21.37,4.29 20.38,5.27 15.18,5.27 14.11,4.2 8.49,4.2 v7.75,3.46
N$5
  Top 0.178: IC2.20 23.48,8.58 23.56,8.51 23.56,7.06 Y1.3 24.32,6.29 C19.2
N$6
  Top 0.178: R6.1 25.97,9.27 Y1.1 26.73,7.55 26.73,6.35 C20.2
N$7
  Top 0.178: R6.2 24.67,8.98 IC2.21
N$8
  Top 0.203: R8.2 7.76,7.16 D1.A
NEOPIX
  Top 0.203: IC2.28 22.86,11.82 22.86,12.44 23.19,12.77 23.35,12.77 LED1.1
QSPI_CS
  Top 0.178: IC2.56 14.95,6.58 14.85,6.48 14.85,5 14.92,5 | U5.1 11.12,3.65 12.29,2.47 14.27,2.47 14.85,3.05 14.85,4.93 14.92,5 | 14.92,5 14.95,5.03 R5.1
  Top 0.203: U5.1 11.09,3.83 R11.1
QSPI_DATA[0]
  Top 0.178: IC2.53 13.8,7.78 U5.5
QSPI_DATA[1]
  Top 0.178: U5.2 11.92,3.38 12.45,2.85 14.05,2.85 14.47,3.27 14.47,6.69 14.76,6.98 IC2.55
QSPI_DATA[2]
  Top 0.178: IC2.54 14.62,7.38 14.09,6.85 14.09,3.43 13.89,3.23 12.83,3.23 12.72,3.35 U5.3
QSPI_DATA[3]
  Top 0.178: U5.7 11.92,7.63 12.87,8.58 IC2.51
QSPI_SCK
  Top 0.178: U5.6 12.72,7.64 13.26,8.18 IC2.52
RAW  (via drill 0.39)
  Top 0.178: v2.55,10.88 3.92,12.26 v4.18,12.26
  Top 0.203: D1.C 9.64,8.32 9.08,8.87 9.08,11.11 9.3,11.33 | U2.1 9.65,11.68 9.3,11.33 | 9.3,11.33 8.04,11.33 7.75,11.62 U2.3 7.64,12.34 C6.1 6.9,13.8 3.81,16.89 | JP1.12C 3.81,17.02 3.81,16.89 | 3.81,16.89 JP1.12
  Bottom 0.178: SJ1.1 0.89,9.38 2.47,10.97 v2.55,10.88 | v4.18,12.26 4.18,16.14 JP1.12
SCL  (via drill 0.39)
  Top 0.178: 28.64,10.48 26.99,12.13 R12.2 | IC2.16 22.3,6.98 21.8,7.48 v21.8,7.73 | v29.34,10.32 29.27,10.32 29.12,10.48 28.64,10.48 | CONN1.4 28.05,10.48 28.64,10.48
  Bottom 0.178: v21.8,7.73 21.87,7.73 22.46,7.13 29.39,7.13 30.15,7.89 30.15,8.47 29.34,9.28 v29.34,10.32
SCLK  (via drill 0.39)
  Top 0.203: JP1.4C JP1.4 | IC2.29 21.97,13.57 21.78,13.75 v21.78,14.03
  Bottom 0.203: JP1.4 23.55,16.51 21.78,14.74 v21.78,14.03
SDA  (via drill 0.39)
  Top 0.178: IC2.15 21.59,6.58 v21.59,6.75 | CONN1.3 29.9,9.39 v30.04,9.53 30.04,10.67 29.65,11.05 28.7,11.05 27.43,12.32 27.43,12.64 26.92,13.14 R10.2
  Bottom 0.178: v30.04,9.53 30.23,9.53 30.54,9.21 30.54,7.75 29.54,6.75 v21.59,6.75
USBBOOT  (via drill 0.39)
  Top 0.178: SW3.A' v30.73,3.07 SW3.A 28.18,3.3 27.63,3.85 D3.C 25.64,5.14 23.6,5.14 23.44,5.3 23.44,5.79 23.11,6.11 22.34,6.11 IC2.14
  Bottom 0.178: TP1.P$1 30.4,3.4 v30.73,3.07
VBUS  (via drill 0.39)
  Top 0.178: X6.B4A9 6.59,6.49 6.99,6.09 6.99,5.77 7.68,5.08 8,5.08
  Top 0.203: R8.1 8,5.08 | X6.A4B9 5.55,11.29 5.36,11.1 4.18,11.1 v3.43,10.35 | X6.B4A9 6.08,6.55 5.58,6.55 5.4,6.73 3.24,6.73 v3.05,6.54
  Bottom 0.178: SJ1.2 2.92,8.95
  Bottom 0.203: v3.43,10.35 2.92,9.84 SJ1.2 | 2.92,8.95 2.92,6.66 v3.05,6.54